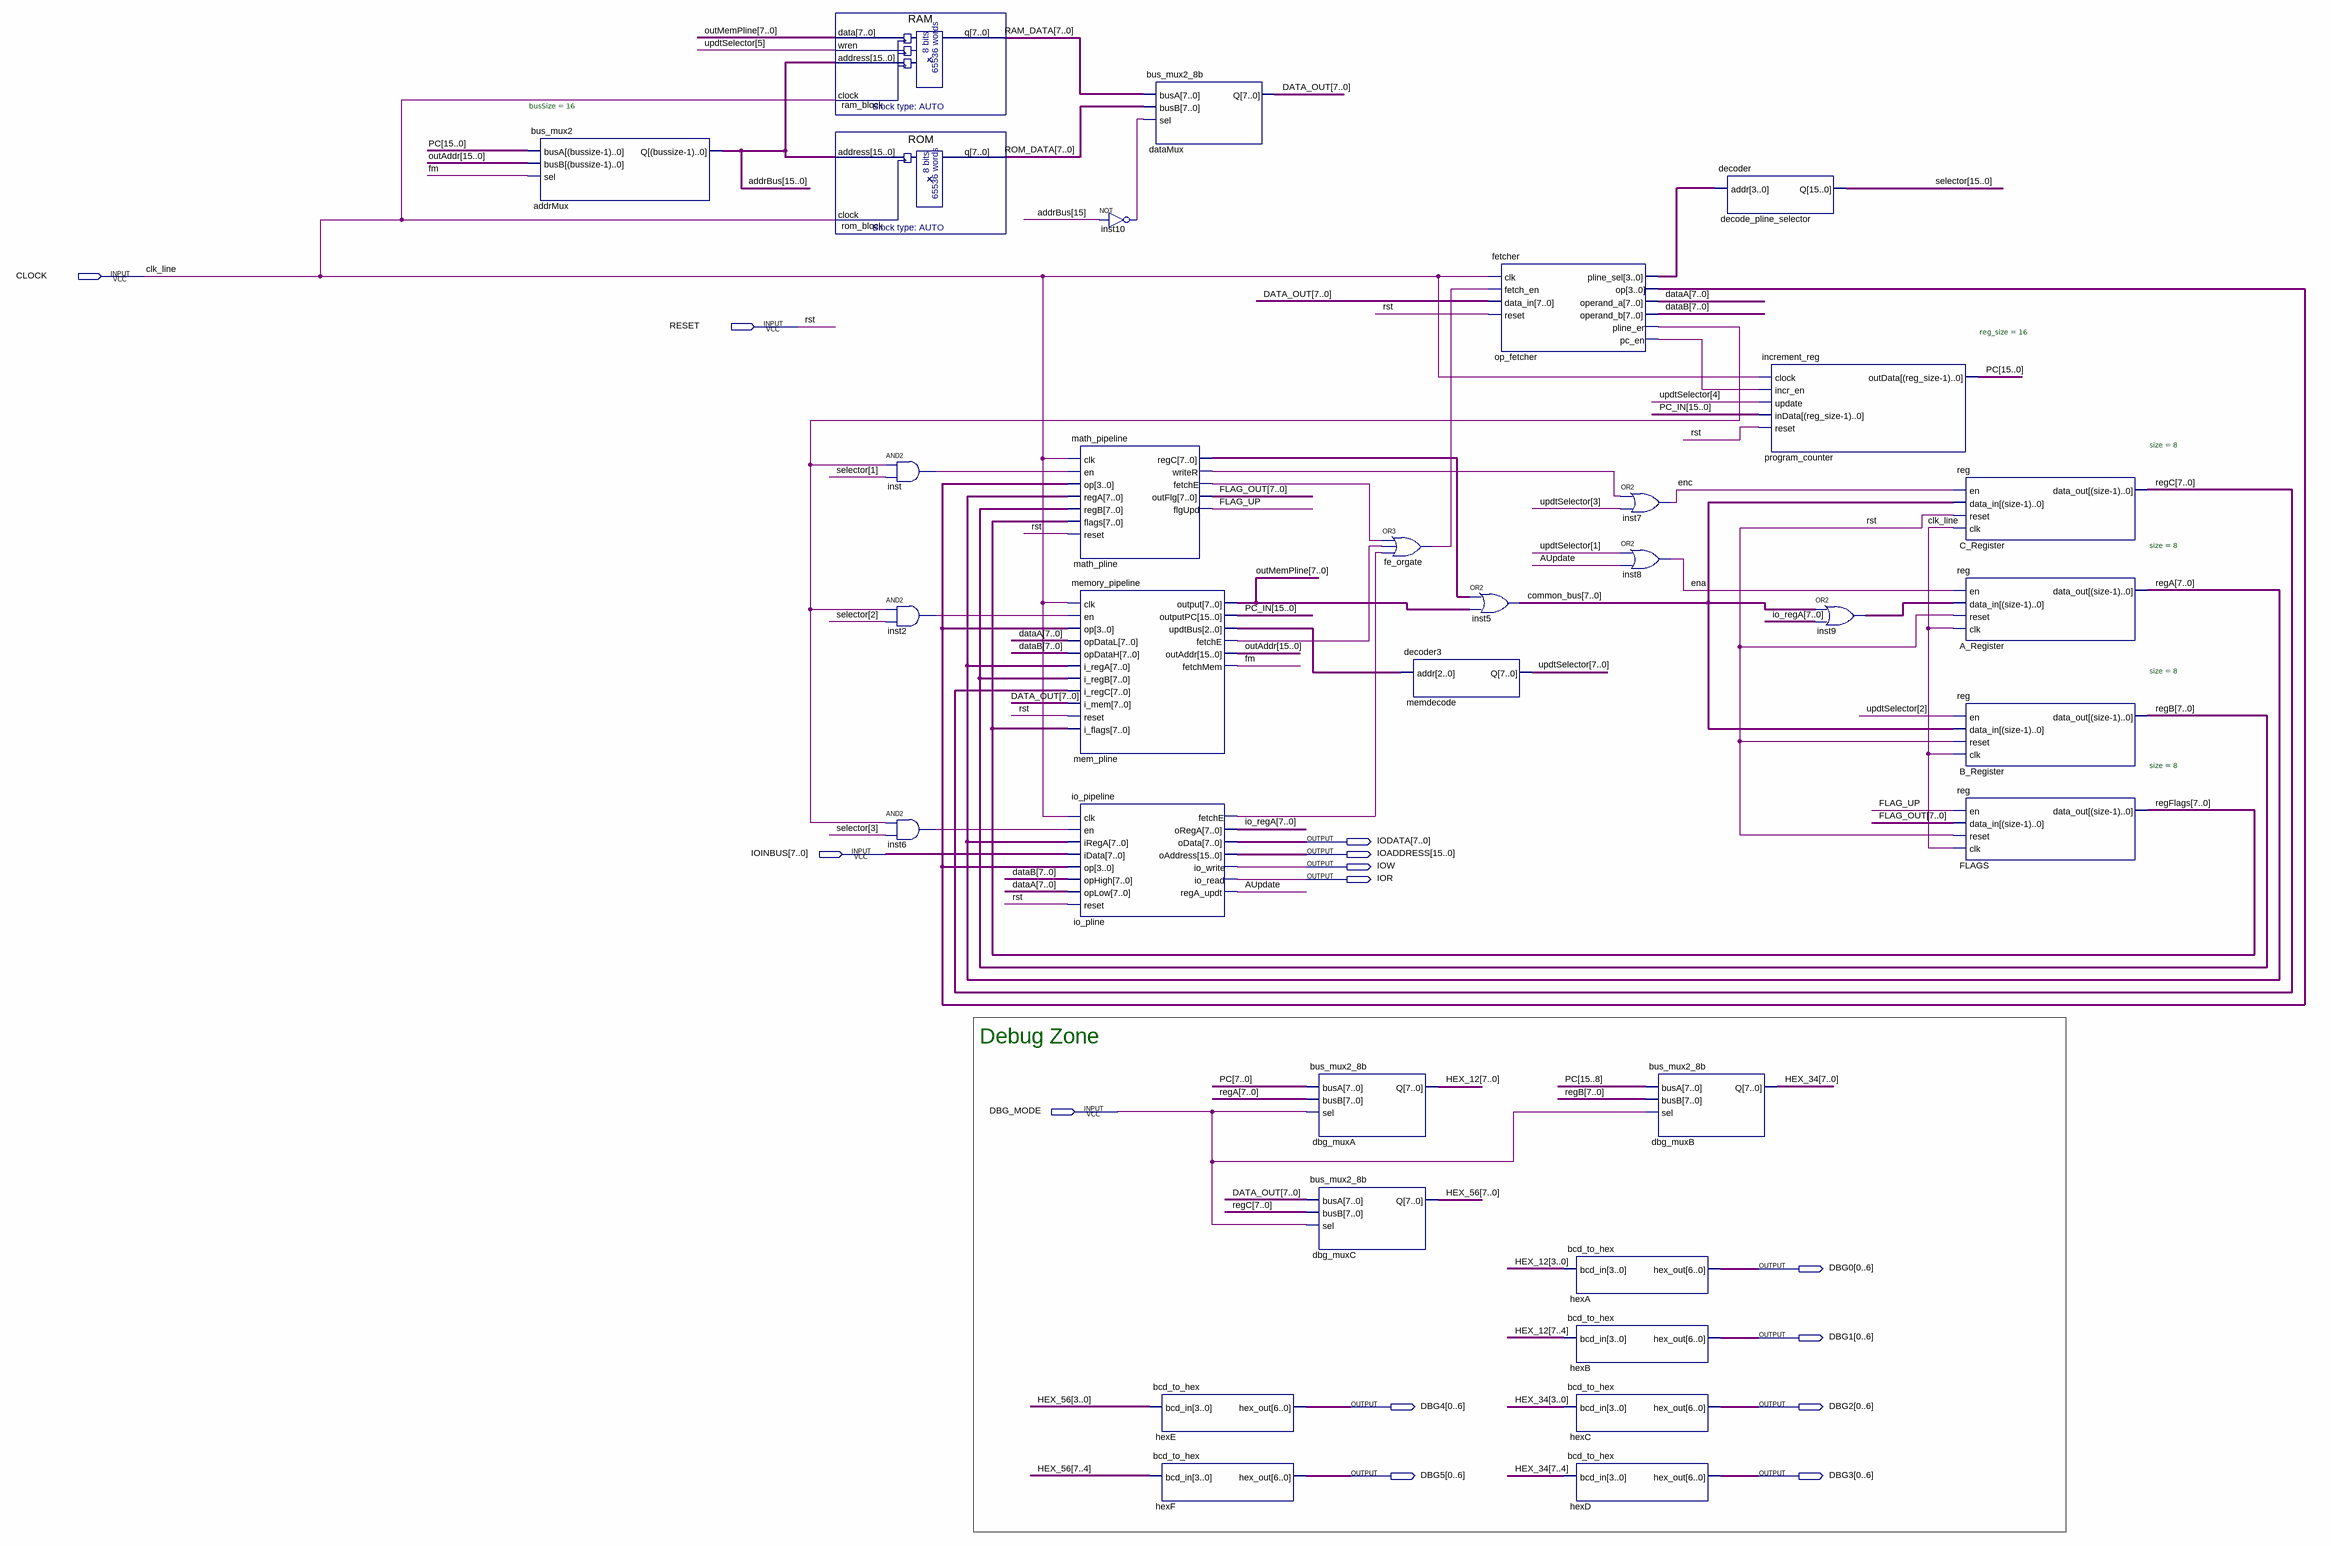
[diagram p0: schematic sheet]
// Quartus schematic mini_cpu.bdf as structural Verilog: 33 symbols, 14 pins
module mini_cpu (
  input  CLOCK,
  input  RESET,
  input  [7:0] IOINBUS,
  input  DBG_MODE,
  output [7:0] IODATA,
  output [15:0] IOADDRESS,
  output IOW,
  output IOR,
  output [0:6] DBG0,
  output [0:6] DBG1,
  output [0:6] DBG4,
  output [0:6] DBG2,
  output [0:6] DBG5,
  output [0:6] DBG3
);

  wire AUpdate, ena, enc, fe_orgate_out, FLAG_UP, fm, inst2_out, inst6_out, inst10_out, inst_out,
       io_pline_fetche, math_pline_fetche, math_pline_writer, mem_pline_fetche, op_fetcher_pc_en,
       op_fetcher_pline_en;
  wire [2:0] mem_pline_updtbus;
  wire [3:0] op_fetcher_op, op_fetcher_pline_sel;
  wire [7:0] common_bus, DATA_OUT, dataA, dataB, FLAG_OUT, HEX_12, HEX_34, HEX_56, inst9_out, io_regA,
       math_pline_regc, outMemPline, RAM_DATA, regA, regB, regC, regFlags, ROM_DATA, updtSelector;
  wire [15:0] addrBus, outAddr, PC, PC_IN, selector;

  bus_mux2 #(.busSize(16)) addrMux (.busA(PC), .busB(outAddr), .sel(fm), .Q(addrBus));
  RAM ram_block (.data(outMemPline), .wren(updtSelector[5]), .address(addrBus), .clock(CLOCK), .q(RAM_DATA));
  ROM rom_block (.address(addrBus), .clock(CLOCK), .q(ROM_DATA));
  and inst (inst_out, op_fetcher_pline_en, selector[1]);
  and inst2 (inst2_out, op_fetcher_pline_en, selector[2]);
  and inst6 (inst6_out, op_fetcher_pline_en, selector[3]);
  not inst10 (inst10_out, addrBus[15]);
  math_pipeline math_pline (
    .clk(CLOCK), .en(inst_out), .op(op_fetcher_op), .regA(regA), .regB(regB), .flags(regFlags),
    .reset(RESET), .regC(math_pline_regc), .writeR(math_pline_writer), .fetchE(math_pline_fetche),
    .outFlg(FLAG_OUT), .flgUpd(FLAG_UP));
  memory_pipeline mem_pline (
    .clk(CLOCK), .en(inst2_out), .op(op_fetcher_op), .opDataL(dataA), .opDataH(dataB), .i_regA(regA),
    .i_regB(regB), .i_regC(regC), .i_mem(DATA_OUT), .reset(RESET), .i_flags(regFlags),
    .\output (outMemPline), .outputPC(PC_IN), .updtBus(mem_pline_updtbus), .fetchE(mem_pline_fetche),
    .outAddr(outAddr), .fetchMem(fm));
  io_pipeline io_pline (
    .clk(CLOCK), .en(inst6_out), .iRegA(regA), .iData(IOINBUS), .op(op_fetcher_op), .opHigh(dataB),
    .opLow(dataA), .reset(RESET), .fetchE(io_pline_fetche), .oRegA(io_regA), .oData(IODATA),
    .oAddress(IOADDRESS), .io_write(IOW), .io_read(IOR), .regA_updt(AUpdate));
  bus_mux2_8b dataMux (.busA(RAM_DATA), .busB(ROM_DATA), .sel(inst10_out), .Q(DATA_OUT));
  bcd_to_hex hexE (.bcd_in(HEX_56[3:0]), .hex_out(DBG4));
  bcd_to_hex hexF (.bcd_in(HEX_56[7:4]), .hex_out(DBG5));
  bus_mux2_8b dbg_muxA (.busA(PC[7:0]), .busB(regA), .sel(DBG_MODE), .Q(HEX_12));
  bus_mux2_8b dbg_muxC (.busA(DATA_OUT), .busB(regC), .sel(DBG_MODE), .Q(HEX_56));
  or fe_orgate (fe_orgate_out, math_pline_fetche, mem_pline_fetche, io_pline_fetche);
  decoder3 memdecode (.addr(mem_pline_updtbus), .Q(updtSelector));
  fetcher op_fetcher (
    .clk(CLOCK), .fetch_en(fe_orgate_out), .data_in(DATA_OUT), .reset(RESET),
    .pline_sel(op_fetcher_pline_sel), .op(op_fetcher_op), .operand_a(dataA), .operand_b(dataB),
    .pline_en(op_fetcher_pline_en), .pc_en(op_fetcher_pc_en));
  assign common_bus = math_pline_regc | outMemPline;  // OR2 inst5, 8 bits wide
  bcd_to_hex hexA (.bcd_in(HEX_12[3:0]), .hex_out(DBG0));
  bcd_to_hex hexB (.bcd_in(HEX_12[7:4]), .hex_out(DBG1));
  bcd_to_hex hexC (.bcd_in(HEX_34[3:0]), .hex_out(DBG2));
  bcd_to_hex hexD (.bcd_in(HEX_34[7:4]), .hex_out(DBG3));
  or inst7 (enc, math_pline_writer, updtSelector[3]);
  or inst8 (ena, updtSelector[1], AUpdate);
  bus_mux2_8b dbg_muxB (.busA(PC[15:8]), .busB(regB), .sel(DBG_MODE), .Q(HEX_34));
  decoder decode_pline_selector (.addr(op_fetcher_pline_sel), .Q(selector));
  increment_reg #(.reg_size(16)) program_counter (
    .clock(CLOCK), .incr_en(op_fetcher_pc_en), .update(updtSelector[4]), .inData(PC_IN), .reset(RESET),
    .outData(PC));
  assign inst9_out = common_bus | io_regA;  // OR2 inst9, 8 bits wide
  \reg  #(.size(8)) C_Register (.en(enc), .data_in(common_bus), .reset(RESET), .clk(CLOCK), .data_out(regC));
  \reg  #(.size(8)) A_Register (.en(ena), .data_in(inst9_out), .reset(RESET), .clk(CLOCK), .data_out(regA));
  \reg  #(.size(8)) B_Register (
    .en(updtSelector[2]), .data_in(common_bus), .reset(RESET), .clk(CLOCK), .data_out(regB));
  \reg  #(.size(8)) FLAGS (.en(FLAG_UP), .data_in(FLAG_OUT), .reset(RESET), .clk(CLOCK), .data_out(regFlags));

  // Other names for the same wires on the sheet: clk_line = CLOCK; rst = RESET

  // Notes on the sheet:
  //   Debug Zone
endmodule
